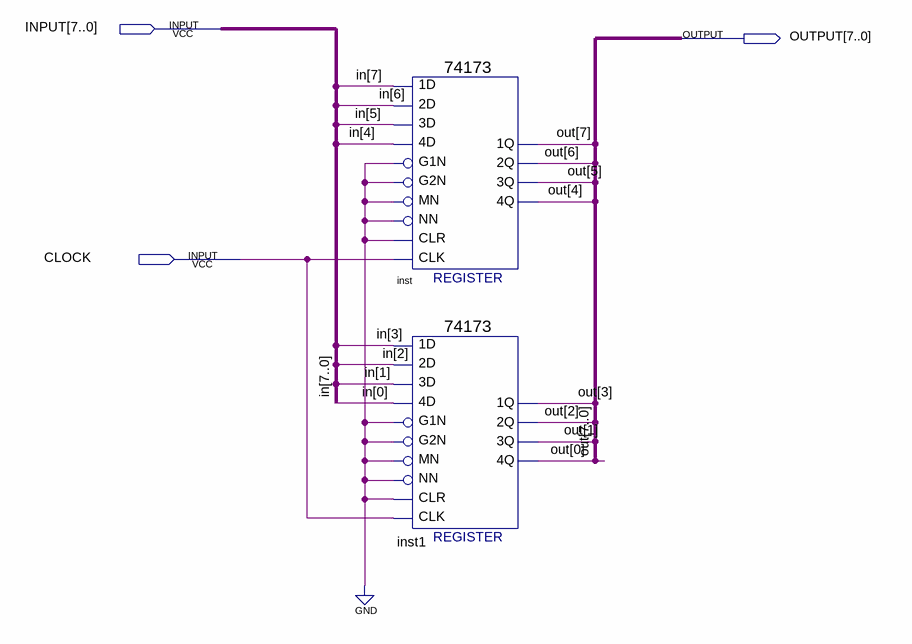
[diagram p0: schematic sheet]
// Quartus schematic 8BitRegister.bdf as structural Verilog: 2 symbols, 3 pins
module \8BitRegister  (
  input  [7:0] INPUT,
  input  CLOCK,
  output [7:0] OUTPUT
);

  \74173  inst (
    .\3D (INPUT[5]), .MN(1'b0), .\1D (INPUT[7]), .\2D (INPUT[6]), .\4D (INPUT[4]), .G1N(1'b0), .G2N(1'b0),
    .NN(1'b0), .CLR(1'b0), .CLK(CLOCK), .\3Q (OUTPUT[5]), .\2Q (OUTPUT[6]), .\1Q (OUTPUT[7]), .\4Q (OUTPUT[4]));
  \74173  inst1 (
    .\3D (INPUT[1]), .MN(1'b0), .\1D (INPUT[3]), .\2D (INPUT[2]), .\4D (INPUT[0]), .G1N(1'b0), .G2N(1'b0),
    .NN(1'b0), .CLR(1'b0), .CLK(CLOCK), .\3Q (OUTPUT[1]), .\2Q (OUTPUT[2]), .\1Q (OUTPUT[3]), .\4Q (OUTPUT[0]));

  // Other names for the same wires on the sheet: in[7:0] = INPUT; out[7:0] = OUTPUT
endmodule
